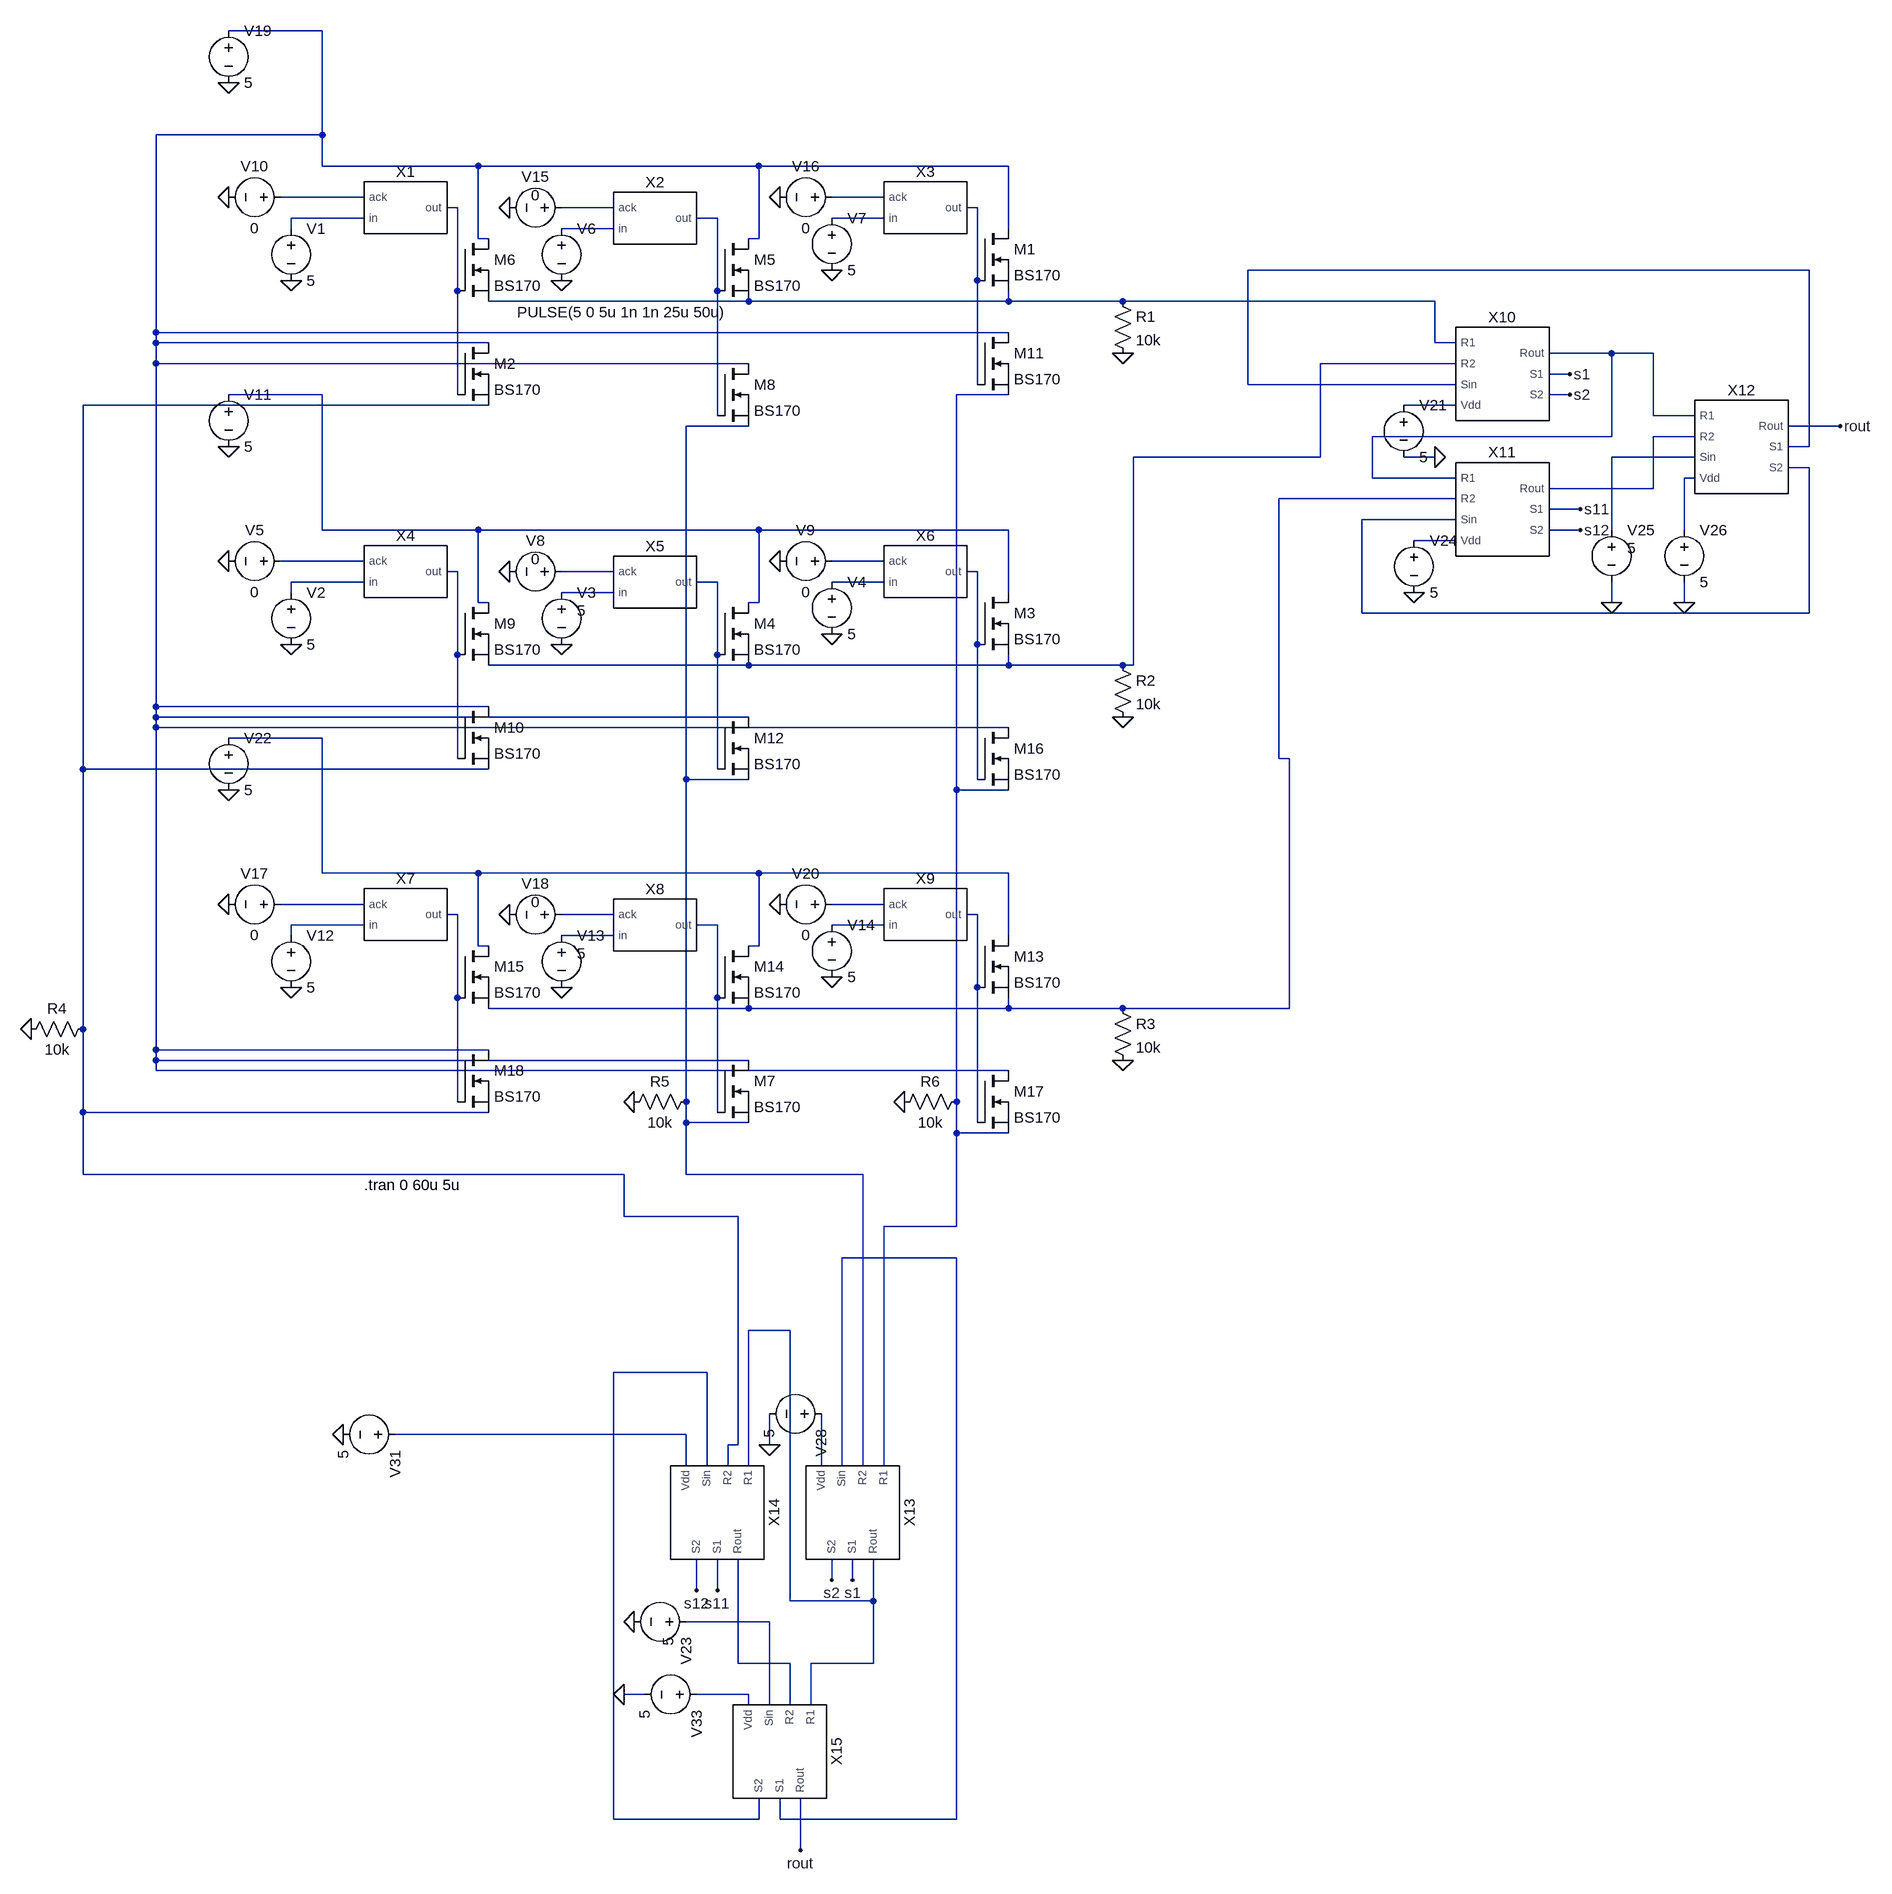
[diagram p0: schematic array.asc]
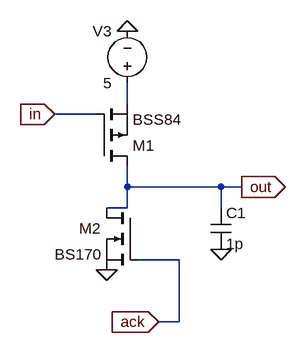
[diagram p1: sub-circuit pixel.asc]
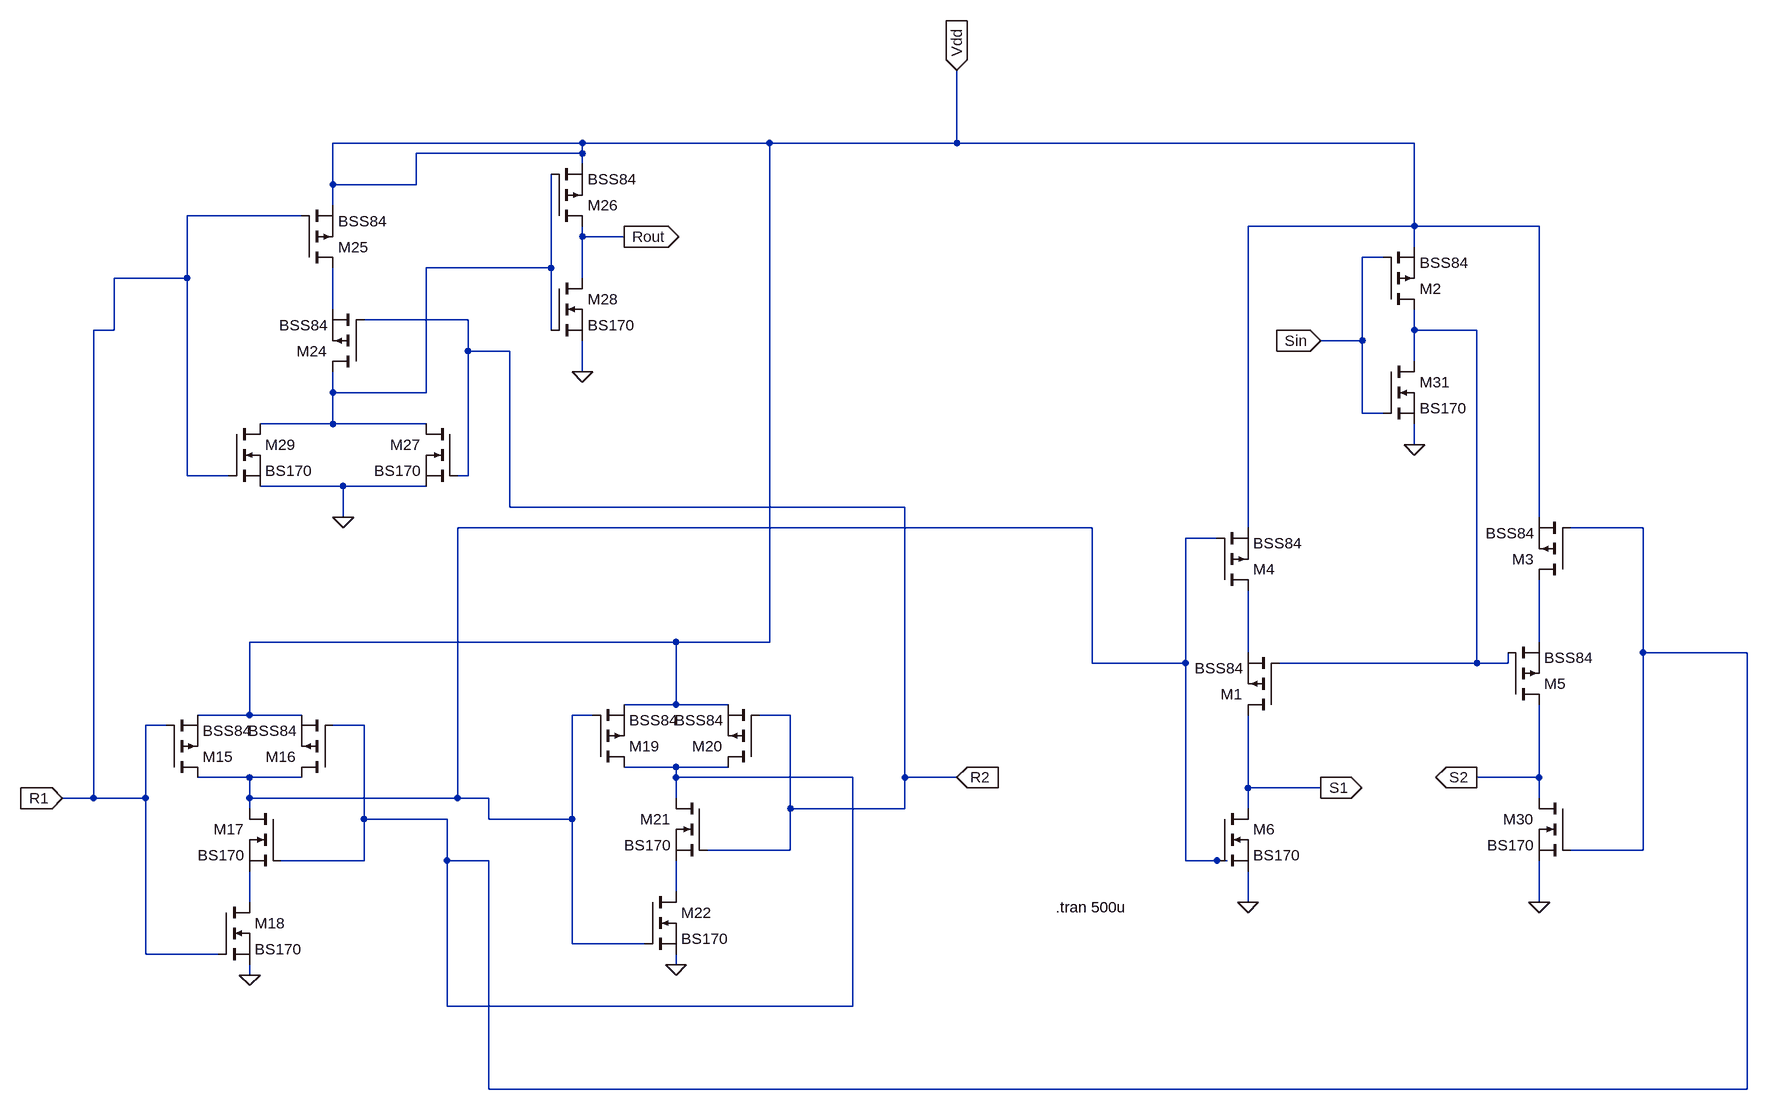
[diagram p2: sub-circuit arbiter.asc]
array.asc, the LTspice schematic file:
Version 4.1
SHEET 1 2416 2684
WIRE 16 -208 -128 -208
WIRE 16 -48 16 -208
WIRE 16 -48 -240 -48
WIRE 16 0 16 -48
WIRE 256 0 16 0
WIRE 688 0 256 0
WIRE 1072 0 688 0
WIRE 80 48 -48 48
WIRE 880 48 800 48
WIRE 224 64 208 64
WIRE 464 64 384 64
WIRE 1024 64 1008 64
WIRE 80 80 -32 80
WIRE 624 80 592 80
WIRE 880 80 800 80
WIRE -32 96 -32 80
WIRE 464 96 384 96
WIRE 1072 96 1072 0
WIRE 256 112 256 0
WIRE 272 112 256 112
WIRE 688 112 688 0
WIRE 688 112 672 112
WIRE 2304 160 1440 160
WIRE 1024 176 1024 64
WIRE 224 192 224 64
WIRE 624 192 624 80
WIRE 672 208 272 208
WIRE 1072 208 1072 192
WIRE 1072 208 672 208
WIRE 1248 208 1072 208
WIRE 1728 208 1248 208
WIRE -240 256 -240 -48
WIRE 1072 256 -240 256
WIRE -240 272 -240 256
WIRE 272 272 -240 272
WIRE 1728 272 1728 208
WIRE 1760 272 1728 272
WIRE 2000 288 1904 288
WIRE 2064 288 2000 288
WIRE -240 304 -240 272
WIRE 672 304 -240 304
WIRE 1760 304 1552 304
WIRE 1936 320 1904 320
WIRE 1024 336 1024 176
WIRE 1440 336 1440 160
WIRE 1760 336 1440 336
WIRE 16 352 -128 352
WIRE 224 352 224 192
WIRE 1072 352 992 352
WIRE 1936 352 1904 352
WIRE 272 368 -352 368
WIRE 1760 368 1680 368
WIRE 624 384 624 192
WIRE 2064 384 2064 288
WIRE 2128 384 2064 384
WIRE 672 400 576 400
WIRE 2352 400 2272 400
WIRE 2000 416 2000 288
WIRE 2000 416 1632 416
WIRE 2128 416 2064 416
WIRE 2304 432 2304 160
WIRE 2304 432 2272 432
WIRE 1552 448 1552 304
WIRE 1552 448 1264 448
WIRE 1728 448 1680 448
WIRE 2128 448 2000 448
WIRE 2304 464 2272 464
WIRE 1632 480 1632 416
WIRE 1760 480 1632 480
WIRE 2128 480 2112 480
WIRE 2064 496 2064 416
WIRE 2064 496 1904 496
WIRE 1760 512 1488 512
WIRE 1952 528 1904 528
WIRE 1760 544 1616 544
WIRE 16 560 16 352
WIRE 256 560 16 560
WIRE 688 560 256 560
WIRE 1072 560 688 560
WIRE 1952 560 1904 560
WIRE 2000 560 2000 448
WIRE 2112 560 2112 480
WIRE 1760 576 1696 576
WIRE 80 608 -48 608
WIRE 880 608 800 608
WIRE 224 624 208 624
WIRE 464 624 384 624
WIRE 1024 624 1008 624
WIRE 80 640 -32 640
WIRE 624 640 592 640
WIRE 880 640 800 640
WIRE -32 656 -32 640
WIRE 464 656 384 656
WIRE 1072 656 1072 560
WIRE 256 672 256 560
WIRE 272 672 256 672
WIRE 688 672 688 560
WIRE 688 672 672 672
WIRE 2000 672 2000 640
WIRE 2112 672 2112 640
WIRE 1616 688 1616 544
WIRE 2304 688 2304 464
WIRE 2304 688 1616 688
WIRE 1024 736 1024 624
WIRE 224 752 224 624
WIRE 624 752 624 640
WIRE 672 768 272 768
WIRE 1072 768 1072 752
WIRE 1072 768 672 768
WIRE 1248 768 1072 768
WIRE 1264 768 1264 448
WIRE 1264 768 1248 768
WIRE -240 832 -240 304
WIRE 272 832 -240 832
WIRE -240 848 -240 832
WIRE 672 848 -240 848
WIRE -240 864 -240 848
WIRE 1072 864 -240 864
WIRE 16 880 -128 880
WIRE 224 912 224 752
WIRE 1488 912 1488 512
WIRE 1504 912 1488 912
WIRE -352 928 -352 368
WIRE 272 928 -352 928
WIRE 624 928 624 752
WIRE 576 944 576 400
WIRE 672 944 576 944
WIRE 1024 944 1024 736
WIRE 992 960 992 352
WIRE 1072 960 992 960
WIRE 16 1088 16 880
WIRE 256 1088 16 1088
WIRE 688 1088 256 1088
WIRE 1072 1088 688 1088
WIRE 80 1136 -48 1136
WIRE 880 1136 800 1136
WIRE 224 1152 208 1152
WIRE 464 1152 384 1152
WIRE 1024 1152 1008 1152
WIRE 80 1168 -32 1168
WIRE 624 1168 592 1168
WIRE 880 1168 800 1168
WIRE -32 1184 -32 1168
WIRE 464 1184 384 1184
WIRE 1072 1184 1072 1088
WIRE 256 1200 256 1088
WIRE 272 1200 256 1200
WIRE 688 1200 688 1088
WIRE 688 1200 672 1200
WIRE 1024 1264 1024 1152
WIRE 224 1280 224 1152
WIRE 624 1280 624 1168
WIRE 672 1296 272 1296
WIRE 1072 1296 1072 1280
WIRE 1072 1296 672 1296
WIRE 1248 1296 1072 1296
WIRE 1504 1296 1504 912
WIRE 1504 1296 1248 1296
WIRE -352 1328 -352 928
WIRE -240 1360 -240 864
WIRE 272 1360 -240 1360
WIRE -240 1376 -240 1360
WIRE 672 1376 -240 1376
WIRE -240 1392 -240 1376
WIRE 1072 1392 -240 1392
WIRE 224 1440 224 1280
WIRE 576 1440 576 944
WIRE 992 1440 992 960
WIRE -352 1456 -352 1328
WIRE 272 1456 -352 1456
WIRE 624 1456 624 1280
WIRE 576 1472 576 1440
WIRE 672 1472 576 1472
WIRE 1024 1472 1024 1264
WIRE 992 1488 992 1440
WIRE 1072 1488 992 1488
WIRE -352 1552 -352 1456
WIRE 480 1552 -352 1552
WIRE 576 1552 576 1472
WIRE 848 1552 576 1552
WIRE 480 1616 480 1552
WIRE 656 1616 480 1616
WIRE 992 1632 992 1488
WIRE 992 1632 880 1632
WIRE 992 1680 816 1680
WIRE 736 1792 672 1792
WIRE 608 1856 464 1856
WIRE 576 1952 128 1952
WIRE 656 1968 656 1616
WIRE 656 1968 640 1968
WIRE 704 1968 704 1920
WIRE 576 2000 576 1952
WIRE 608 2000 608 1856
WIRE 640 2000 640 1968
WIRE 672 2000 672 1792
WIRE 784 2000 784 1920
WIRE 816 2000 816 1680
WIRE 848 2000 848 1552
WIRE 880 2000 880 1632
WIRE 800 2176 800 2144
WIRE 832 2176 832 2144
WIRE 592 2192 592 2144
WIRE 624 2192 624 2144
WIRE 736 2208 736 1792
WIRE 864 2208 864 2144
WIRE 864 2208 736 2208
WIRE 704 2240 576 2240
WIRE 656 2304 656 2144
WIRE 736 2304 656 2304
WIRE 864 2304 864 2208
WIRE 864 2304 768 2304
WIRE 512 2352 480 2352
WIRE 672 2352 592 2352
WIRE 672 2368 672 2352
WIRE 704 2368 704 2240
WIRE 736 2368 736 2304
WIRE 768 2368 768 2304
WIRE 464 2544 464 1856
WIRE 688 2544 688 2512
WIRE 688 2544 464 2544
WIRE 720 2544 720 2512
WIRE 992 2544 992 1680
WIRE 992 2544 720 2544
WIRE 752 2592 752 2512
FLAG -32 176 0
FLAG 384 176 0
FLAG 800 160 0
FLAG -128 48 0
FLAG 304 64 0
FLAG 720 48 0
FLAG 1728 448 0
FLAG 1696 656 0
FLAG 2000 672 0
FLAG 2112 672 0
FLAG 1936 320 s1
FLAG 1936 352 s2
FLAG 1952 528 s11
FLAG 1952 560 s12
FLAG 2352 400 rout
FLAG -128 -128 0
FLAG 1248 288 0
FLAG -32 736 0
FLAG 384 736 0
FLAG 800 720 0
FLAG -128 608 0
FLAG 304 624 0
FLAG 720 608 0
FLAG -128 432 0
FLAG 1248 848 0
FLAG -32 1264 0
FLAG 384 1264 0
FLAG 800 1248 0
FLAG -128 1136 0
FLAG 304 1152 0
FLAG 720 1136 0
FLAG -128 960 0
FLAG 1248 1376 0
FLAG -432 1328 0
FLAG 496 1440 0
FLAG 912 1440 0
FLAG 704 1968 0
FLAG 48 1952 0
FLAG 480 2352 0
FLAG 832 2176 s1
FLAG 800 2176 s2
FLAG 624 2192 s11
FLAG 592 2192 s12
FLAG 752 2592 rout
FLAG 496 2240 0
SYMBOL pixel 144 64 R0
SYMATTR InstName X1
SYMBOL pixel 528 80 R0
SYMATTR InstName X2
SYMBOL pixel 944 64 R0
SYMATTR InstName X3
SYMBOL voltage -32 80 R0
WINDOW 123 0 0 Left 0
WINDOW 39 0 0 Left 0
SYMATTR InstName V1
SYMATTR Value 5
SYMBOL voltage 384 80 R0
WINDOW 3 -68 145 Left 2
WINDOW 123 0 0 Left 0
WINDOW 39 0 0 Left 0
SYMATTR Value PULSE(5 0 5u 1n 1n 25u 50u)
SYMATTR InstName V6
SYMBOL voltage 800 64 R0
WINDOW 123 0 0 Left 0
WINDOW 39 0 0 Left 0
SYMATTR InstName V7
SYMATTR Value 5
SYMBOL voltage -32 48 R90
WINDOW 0 -32 56 VBottom 2
WINDOW 3 32 56 VTop 2
WINDOW 123 0 0 Left 0
WINDOW 39 0 0 Left 0
SYMATTR InstName V10
SYMATTR Value 0
SYMBOL voltage 400 64 R90
WINDOW 0 -32 56 VBottom 2
WINDOW 3 -4 56 VBottom 2
WINDOW 123 0 0 Left 0
WINDOW 39 0 0 Left 0
SYMATTR InstName V15
SYMATTR Value 0
SYMBOL voltage 816 48 R90
WINDOW 0 -32 56 VBottom 2
WINDOW 3 32 56 VTop 2
WINDOW 123 0 0 Left 0
WINDOW 39 0 0 Left 0
SYMATTR InstName V16
SYMATTR Value 0
SYMBOL arbiter 1824 320 R0
SYMATTR InstName X10
SYMBOL arbiter 1824 528 R0
SYMATTR InstName X11
SYMBOL arbiter 2192 432 R0
SYMATTR InstName X12
SYMBOL voltage 1680 352 R0
WINDOW 123 0 0 Left 0
WINDOW 39 0 0 Left 0
SYMATTR InstName V21
SYMATTR Value 5
SYMBOL voltage 1696 560 R0
WINDOW 123 0 0 Left 0
WINDOW 39 0 0 Left 0
SYMATTR InstName V24
SYMATTR Value 5
SYMBOL voltage 2000 544 R0
WINDOW 3 24 44 Left 2
WINDOW 123 0 0 Left 0
WINDOW 39 0 0 Left 0
SYMATTR Value 5
SYMATTR InstName V25
SYMBOL voltage 2112 544 R0
WINDOW 123 0 0 Left 0
WINDOW 39 0 0 Left 0
SYMATTR InstName V26
SYMATTR Value 5
SYMBOL voltage -128 -224 R0
WINDOW 123 0 0 Left 0
WINDOW 39 0 0 Left 0
SYMATTR InstName V19
SYMATTR Value 5
SYMBOL nmos 1024 96 R0
SYMATTR InstName M1
SYMATTR Value BS170
SYMBOL nmos 624 112 R0
SYMATTR InstName M5
SYMATTR Value BS170
SYMBOL nmos 224 112 R0
SYMATTR InstName M6
SYMATTR Value BS170
SYMBOL res 1232 192 R0
SYMATTR InstName R1
SYMATTR Value 10k
SYMBOL nmos 224 272 R0
SYMATTR InstName M2
SYMATTR Value BS170
SYMBOL pixel 144 624 R0
SYMATTR InstName X4
SYMBOL pixel 528 640 R0
SYMATTR InstName X5
SYMBOL pixel 944 624 R0
SYMATTR InstName X6
SYMBOL voltage -32 640 R0
WINDOW 123 0 0 Left 0
WINDOW 39 0 0 Left 0
SYMATTR InstName V2
SYMATTR Value 5
SYMBOL voltage 384 640 R0
WINDOW 3 24 44 Left 2
WINDOW 123 0 0 Left 0
WINDOW 39 0 0 Left 0
SYMATTR Value 5
SYMATTR InstName V3
SYMBOL voltage 800 624 R0
WINDOW 123 0 0 Left 0
WINDOW 39 0 0 Left 0
SYMATTR InstName V4
SYMATTR Value 5
SYMBOL voltage -32 608 R90
WINDOW 0 -32 56 VBottom 2
WINDOW 3 32 56 VTop 2
WINDOW 123 0 0 Left 0
WINDOW 39 0 0 Left 0
SYMATTR InstName V5
SYMATTR Value 0
SYMBOL voltage 400 624 R90
WINDOW 0 -32 56 VBottom 2
WINDOW 3 -4 56 VBottom 2
WINDOW 123 0 0 Left 0
WINDOW 39 0 0 Left 0
SYMATTR InstName V8
SYMATTR Value 0
SYMBOL voltage 816 608 R90
WINDOW 0 -32 56 VBottom 2
WINDOW 3 32 56 VTop 2
WINDOW 123 0 0 Left 0
WINDOW 39 0 0 Left 0
SYMATTR InstName V9
SYMATTR Value 0
SYMBOL voltage -128 336 R0
WINDOW 123 0 0 Left 0
WINDOW 39 0 0 Left 0
SYMATTR InstName V11
SYMATTR Value 5
SYMBOL nmos 1024 656 R0
SYMATTR InstName M3
SYMATTR Value BS170
SYMBOL nmos 624 672 R0
SYMATTR InstName M4
SYMATTR Value BS170
SYMBOL nmos 224 672 R0
SYMATTR InstName M9
SYMATTR Value BS170
SYMBOL res 1232 752 R0
SYMATTR InstName R2
SYMATTR Value 10k
SYMBOL nmos 224 832 R0
SYMATTR InstName M10
SYMATTR Value BS170
SYMBOL pixel 144 1152 R0
SYMATTR InstName X7
SYMBOL pixel 528 1168 R0
SYMATTR InstName X8
SYMBOL pixel 944 1152 R0
SYMATTR InstName X9
SYMBOL voltage -32 1168 R0
WINDOW 123 0 0 Left 0
WINDOW 39 0 0 Left 0
SYMATTR InstName V12
SYMATTR Value 5
SYMBOL voltage 384 1168 R0
WINDOW 3 24 44 Left 2
WINDOW 123 0 0 Left 0
WINDOW 39 0 0 Left 0
SYMATTR Value 5
SYMATTR InstName V13
SYMBOL voltage 800 1152 R0
WINDOW 123 0 0 Left 0
WINDOW 39 0 0 Left 0
SYMATTR InstName V14
SYMATTR Value 5
SYMBOL voltage -32 1136 R90
WINDOW 0 -32 56 VBottom 2
WINDOW 3 32 56 VTop 2
WINDOW 123 0 0 Left 0
WINDOW 39 0 0 Left 0
SYMATTR InstName V17
SYMATTR Value 0
SYMBOL voltage 400 1152 R90
WINDOW 0 -32 56 VBottom 2
WINDOW 3 -4 56 VBottom 2
WINDOW 123 0 0 Left 0
WINDOW 39 0 0 Left 0
SYMATTR InstName V18
SYMATTR Value 0
SYMBOL voltage 816 1136 R90
WINDOW 0 -32 56 VBottom 2
WINDOW 3 32 56 VTop 2
WINDOW 123 0 0 Left 0
WINDOW 39 0 0 Left 0
SYMATTR InstName V20
SYMATTR Value 0
SYMBOL voltage -128 864 R0
WINDOW 123 0 0 Left 0
WINDOW 39 0 0 Left 0
SYMATTR InstName V22
SYMATTR Value 5
SYMBOL nmos 1024 1184 R0
SYMATTR InstName M13
SYMATTR Value BS170
SYMBOL nmos 624 1200 R0
SYMATTR InstName M14
SYMATTR Value BS170
SYMBOL nmos 224 1200 R0
SYMATTR InstName M15
SYMATTR Value BS170
SYMBOL res 1232 1280 R0
SYMATTR InstName R3
SYMATTR Value 10k
SYMBOL nmos 224 1360 R0
SYMATTR InstName M18
SYMATTR Value BS170
SYMBOL res -336 1312 R90
WINDOW 0 0 56 VBottom 2
WINDOW 3 32 56 VTop 2
SYMATTR InstName R4
SYMATTR Value 10k
SYMBOL nmos 624 304 R0
SYMATTR InstName M8
SYMATTR Value BS170
SYMBOL nmos 1024 256 R0
SYMATTR InstName M11
SYMATTR Value BS170
SYMBOL nmos 624 848 R0
SYMATTR InstName M12
SYMATTR Value BS170
SYMBOL nmos 1024 864 R0
SYMATTR InstName M16
SYMATTR Value BS170
SYMBOL nmos 624 1376 R0
SYMATTR InstName M7
SYMATTR Value BS170
SYMBOL nmos 1024 1392 R0
SYMATTR InstName M17
SYMATTR Value BS170
SYMBOL res 592 1424 R90
WINDOW 0 0 56 VBottom 2
WINDOW 3 32 56 VTop 2
SYMATTR InstName R5
SYMATTR Value 10k
SYMBOL res 1008 1424 R90
WINDOW 0 0 56 VBottom 2
WINDOW 3 32 56 VTop 2
SYMATTR InstName R6
SYMATTR Value 10k
SYMBOL arbiter 832 2064 R90
SYMATTR InstName X13
SYMBOL arbiter 624 2064 R90
SYMATTR InstName X14
SYMBOL arbiter 720 2432 R90
SYMATTR InstName X15
SYMBOL voltage 800 1920 R90
WINDOW 123 0 0 Left 0
WINDOW 39 0 0 Left 0
SYMATTR InstName V28
SYMATTR Value 5
SYMBOL voltage 144 1952 R90
WINDOW 123 0 0 Left 0
WINDOW 39 0 0 Left 0
SYMATTR InstName V31
SYMATTR Value 5
SYMBOL voltage 608 2352 R90
WINDOW 123 0 0 Left 0
WINDOW 39 0 0 Left 0
SYMATTR InstName V33
SYMATTR Value 5
SYMBOL voltage 592 2240 R90
WINDOW 3 24 44 Left 2
WINDOW 123 0 0 Left 0
WINDOW 39 0 0 Left 0
SYMATTR Value 5
SYMATTR InstName V23
TEXT 80 1568 Left 2 !.tran 0 60u 5u

pixel.asc, the sub-circuit schematic file:
Version 4.1
SHEET 1 880 680
WIRE 304 0 304 -32
WIRE 256 16 192 16
WIRE 304 128 304 96
WIRE 448 128 304 128
WIRE 480 128 448 128
WIRE 304 160 304 128
WIRE 304 160 272 160
WIRE 448 160 448 128
WIRE 384 240 320 240
WIRE 384 336 384 240
WIRE 384 336 352 336
FLAG 448 224 0
FLAG 272 256 0
FLAG 304 -112 0
FLAG 480 128 out
IOPIN 480 128 Out
FLAG 352 336 ack
IOPIN 352 336 In
FLAG 192 16 in
IOPIN 192 16 In
SYMBOL pmos 256 96 M180
SYMATTR InstName M1
SYMATTR Value BSS84
SYMBOL nmos 320 160 M0
SYMATTR InstName M2
SYMATTR Value BS170
SYMBOL cap 432 160 R0
SYMATTR InstName C1
SYMATTR Value 1p
SYMBOL voltage 304 -16 R180
WINDOW 0 24 96 Left 2
WINDOW 3 24 16 Left 2
WINDOW 123 0 0 Left 0
WINDOW 39 0 0 Left 0
SYMATTR InstName V3
SYMATTR Value 5

arbiter.asc, the sub-circuit schematic file:
Version 4.1
SHEET 1 3980 2180
WIRE 464 0 80 0
WIRE 752 0 464 0
WIRE 1040 0 1040 -112
WIRE 1040 0 752 0
WIRE 1744 0 1040 0
WIRE 464 16 464 0
WIRE 464 16 208 16
WIRE 464 32 464 16
WIRE 80 64 80 0
WIRE 208 64 208 16
WIRE 208 64 80 64
WIRE 80 96 80 64
WIRE 32 112 -144 112
WIRE 1744 128 1744 0
WIRE 1744 128 1488 128
WIRE 1936 128 1744 128
WIRE 464 144 464 128
WIRE 528 144 464 144
WIRE 1744 160 1744 128
WIRE 1696 176 1664 176
WIRE 416 192 416 48
WIRE 416 192 224 192
WIRE -144 208 -144 112
WIRE -144 208 -256 208
WIRE 464 208 464 144
WIRE 80 256 80 192
WIRE 288 272 128 272
WIRE -256 288 -256 208
WIRE -256 288 -288 288
WIRE 416 288 416 192
WIRE 1744 288 1744 256
WIRE 1840 288 1744 288
WIRE 1664 304 1664 176
WIRE 1664 304 1600 304
WIRE 288 320 288 272
WIRE 352 320 288 320
WIRE 1744 336 1744 288
WIRE 464 352 464 304
WIRE 80 384 80 352
WIRE 224 384 224 192
WIRE 224 384 80 384
WIRE 1664 416 1664 304
WIRE 1696 416 1664 416
WIRE 80 432 80 384
WIRE 80 432 -32 432
WIRE 224 432 80 432
WIRE 1744 464 1744 432
WIRE -144 512 -144 208
WIRE -80 512 -144 512
WIRE 288 512 288 320
WIRE 288 512 272 512
WIRE 96 528 -32 528
WIRE 224 528 96 528
WIRE 352 560 352 320
WIRE 960 560 352 560
WIRE 96 576 96 528
WIRE 1936 576 1936 128
WIRE 1248 592 272 592
WIRE 1488 592 1488 128
WIRE 2096 592 1984 592
WIRE 1440 608 1392 608
WIRE 608 768 -48 768
WIRE 752 768 752 0
WIRE 752 768 608 768
WIRE 1936 768 1936 672
WIRE 1488 784 1488 688
WIRE 2096 784 2096 592
WIRE 2256 784 2096 784
WIRE 1248 800 1248 592
WIRE 1392 800 1392 608
WIRE 1392 800 1248 800
WIRE 1840 800 1840 288
WIRE 1840 800 1536 800
WIRE 1888 800 1888 784
WIRE 1888 800 1840 800
WIRE 608 864 608 768
WIRE 608 864 528 864
WIRE 688 864 608 864
WIRE -48 880 -48 768
WIRE -48 880 -128 880
WIRE 32 880 -48 880
WIRE 480 880 448 880
WIRE 784 880 736 880
WIRE -176 896 -208 896
WIRE 128 896 80 896
WIRE 608 960 528 960
WIRE 688 960 608 960
WIRE -48 976 -128 976
WIRE 32 976 -48 976
WIRE 608 976 608 960
WIRE 880 976 608 976
WIRE 960 976 960 560
WIRE 1040 976 960 976
WIRE 1936 976 1936 864
WIRE 1936 976 1840 976
WIRE 1488 992 1488 880
WIRE 1600 992 1488 992
WIRE -288 1008 -288 288
WIRE -288 1008 -336 1008
WIRE -208 1008 -208 896
WIRE -208 1008 -288 1008
WIRE -48 1008 -48 976
WIRE 272 1008 272 592
WIRE 272 1008 -48 1008
WIRE 320 1008 272 1008
WIRE 608 1008 608 976
WIRE 1936 1008 1936 976
WIRE -48 1024 -48 1008
WIRE 784 1024 784 880
WIRE 960 1024 960 976
WIRE 960 1024 784 1024
WIRE 1488 1024 1488 992
WIRE 128 1040 128 896
WIRE 256 1040 128 1040
WIRE 320 1040 320 1008
WIRE 448 1040 448 880
WIRE 448 1040 320 1040
WIRE 784 1088 784 1024
WIRE 784 1088 656 1088
WIRE 2096 1088 2096 784
WIRE 2096 1088 1984 1088
WIRE 128 1104 128 1040
WIRE 128 1104 0 1104
WIRE 256 1104 256 1040
WIRE 320 1104 256 1104
WIRE 1392 1104 1392 800
WIRE 1440 1104 1392 1104
WIRE 1456 1104 1440 1104
WIRE 608 1152 608 1104
WIRE -48 1168 -48 1120
WIRE 1488 1168 1488 1120
WIRE 1936 1168 1936 1104
WIRE 448 1232 448 1040
WIRE 560 1232 448 1232
WIRE -208 1248 -208 1008
WIRE -96 1248 -208 1248
WIRE 608 1264 608 1248
WIRE -48 1280 -48 1264
WIRE 256 1328 256 1104
WIRE 880 1328 880 976
WIRE 880 1328 256 1328
WIRE 320 1456 320 1104
WIRE 2256 1456 2256 784
WIRE 2256 1456 320 1456
FLAG 528 144 Rout
IOPIN 528 144 Out
FLAG -336 1008 R1
IOPIN -336 1008 In
FLAG 1040 976 R2
IOPIN 1040 976 In
FLAG 1600 992 S1
IOPIN 1600 992 Out
FLAG 1840 976 S2
IOPIN 1840 976 Out
FLAG 1600 304 Sin
IOPIN 1600 304 In
FLAG 1040 -112 Vdd
IOPIN 1040 -112 In
FLAG 96 576 0
FLAG 464 352 0
FLAG 1744 464 0
FLAG 1488 1168 0
FLAG 1936 1168 0
FLAG -48 1280 0
FLAG 608 1264 0
SYMBOL pmos 128 352 R180
SYMATTR InstName M24
SYMATTR Value BSS84
SYMBOL pmos 32 192 M180
SYMATTR InstName M25
SYMATTR Value BSS84
SYMBOL pmos 416 128 M180
SYMATTR InstName M26
SYMATTR Value BSS84
SYMBOL nmos 272 432 M0
SYMATTR InstName M27
SYMATTR Value BS170
SYMBOL nmos 416 208 R0
SYMATTR InstName M28
SYMATTR Value BS170
SYMBOL nmos -80 432 R0
SYMATTR InstName M29
SYMATTR Value BS170
SYMBOL pmos 1536 880 R180
SYMATTR InstName M1
SYMATTR Value BSS84
SYMBOL pmos 1696 256 M180
SYMATTR InstName M2
SYMATTR Value BSS84
SYMBOL pmos 1984 672 R180
SYMATTR InstName M3
SYMATTR Value BSS84
SYMBOL pmos 1440 688 M180
SYMATTR InstName M4
SYMATTR Value BSS84
SYMBOL pmos 1888 864 M180
SYMATTR InstName M5
SYMATTR Value BSS84
SYMBOL nmos 1440 1024 R0
SYMATTR InstName M6
SYMATTR Value BS170
SYMBOL nmos 1984 1008 M0
SYMATTR InstName M30
SYMATTR Value BS170
SYMBOL nmos 1696 336 R0
SYMATTR InstName M31
SYMATTR Value BS170
SYMBOL pmos -176 976 M180
SYMATTR InstName M15
SYMATTR Value BSS84
SYMBOL pmos 80 976 R180
SYMATTR InstName M16
SYMATTR Value BSS84
SYMBOL nmos 0 1024 M0
SYMATTR InstName M17
SYMATTR Value BS170
SYMBOL nmos -96 1168 R0
SYMATTR InstName M18
SYMATTR Value BS170
SYMBOL pmos 480 960 M180
SYMATTR InstName M19
SYMATTR Value BSS84
SYMBOL pmos 736 960 R180
SYMATTR InstName M20
SYMATTR Value BSS84
SYMBOL nmos 656 1008 M0
SYMATTR InstName M21
SYMATTR Value BS170
SYMBOL nmos 560 1152 R0
SYMATTR InstName M22
SYMATTR Value BS170
TEXT 1192 1176 Left 2 !.tran 500u

The netlist it stands for:
* array.asc
X§X1 N002 N007 N004 pixel
X§X2 N005 N010 N008 pixel
X§X3 N003 N009 N006 pixel
V1 N007 0 5
V6 N010 0 PULSE(5 0 5u 1n 1n 25u 50u)
V7 N009 0 5
V10 N002 0 0
V15 N005 0 0
V16 N003 0 0
X§X10 N012 N014 N011 N018 N013 s1 s2 arbiter
X§X11 N013 N024 N022 N025 N020 s11 s12 arbiter
X§X12 N013 N020 N021 N023 rout N011 N022 arbiter
V21 N018 0 5
V24 N025 0 5
V25 N021 0 5
V26 N023 0 5
V19 N001 0 5
M1 N001 N006 N012 N012 BS170
M5 N001 N008 N012 N012 BS170
M6 N001 N004 N012 N012 BS170
R1 N012 0 10k
M2 N001 N004 N017 N017 BS170
X§X4 N026 N031 N028 pixel
X§X5 N029 N034 N032 pixel
X§X6 N027 N033 N030 pixel
V2 N031 0 5
V3 N034 0 5
V4 N033 0 5
V5 N026 0 0
V8 N029 0 0
V9 N027 0 0
V11 N015 0 5
M3 N015 N030 N014 N014 BS170
M4 N015 N032 N014 N014 BS170
M9 N015 N028 N014 N014 BS170
R2 N014 0 10k
M10 N001 N028 N017 N017 BS170
X§X7 N036 N041 N038 pixel
X§X8 N039 N044 N042 pixel
X§X9 N037 N043 N040 pixel
V12 N041 0 5
V13 N044 0 5
V14 N043 0 5
V17 N036 0 0
V18 N039 0 0
V20 N037 0 0
V22 N035 0 5
M13 N035 N040 N024 N024 BS170
M14 N035 N042 N024 N024 BS170
M15 N035 N038 N024 N024 BS170
R3 N024 0 10k
M18 N001 N038 N017 N017 BS170
R4 N017 0 10k
M8 N001 N008 N019 N019 BS170
M11 N001 N006 N016 N016 BS170
M12 N001 N032 N019 N019 BS170
M16 N001 N030 N016 N016 BS170
M7 N001 N042 N019 N019 BS170
M17 N001 N040 N016 N016 BS170
R5 N019 0 10k
R6 N016 0 10k
X§X13 N016 N019 N045 N049 N046 s1 s2 arbiter
X§X14 N046 N017 N047 N048 N051 s11 s12 arbiter
X§X15 N046 N051 N050 N052 rout N045 N047 arbiter
V28 N049 0 5
V31 N048 0 5
V33 N052 0 5
V23 N050 0 5

* block symbol definitions
.subckt pixel ack in out
M1 out in N001 N001 BSS84
M2 out ack 0 0 BS170
C1 out 0 1p
V3 N001 0 5
.ends pixel

.subckt arbiter R1 R2 Sin Vdd Rout S1 S2
M24 N001 R2 N002 N002 BSS84
M25 N002 R1 Vdd Vdd BSS84
M26 Rout N001 Vdd Vdd BSS84
M27 N001 R2 0 0 BS170
M28 Rout N001 0 0 BS170
M29 N001 R1 0 0 BS170
M1 S1 N003 N007 N007 BSS84
M2 N003 Sin Vdd Vdd BSS84
M3 N006 N005 Vdd Vdd BSS84
M4 N007 N004 Vdd Vdd BSS84
M5 S2 N003 N006 N006 BSS84
M6 S1 N004 0 0 BS170
M30 S2 N005 0 0 BS170
M31 N003 Sin 0 0 BS170
M15 N004 R1 Vdd Vdd BSS84
M16 N004 N005 Vdd Vdd BSS84
M17 N004 N005 N009 N009 BS170
M18 N009 R1 0 0 BS170
M19 N005 N004 Vdd Vdd BSS84
M20 N005 R2 Vdd Vdd BSS84
M21 N005 R2 N008 N008 BS170
M22 N008 N004 0 0 BS170
.tran 500u
.ends arbiter

.model NMOS NMOS
.model PMOS PMOS
.lib standard.mos
.tran 0 60u 5u
.backanno
.end